# EAGLE design WeMos-shield (EAGLE 7.7.0)
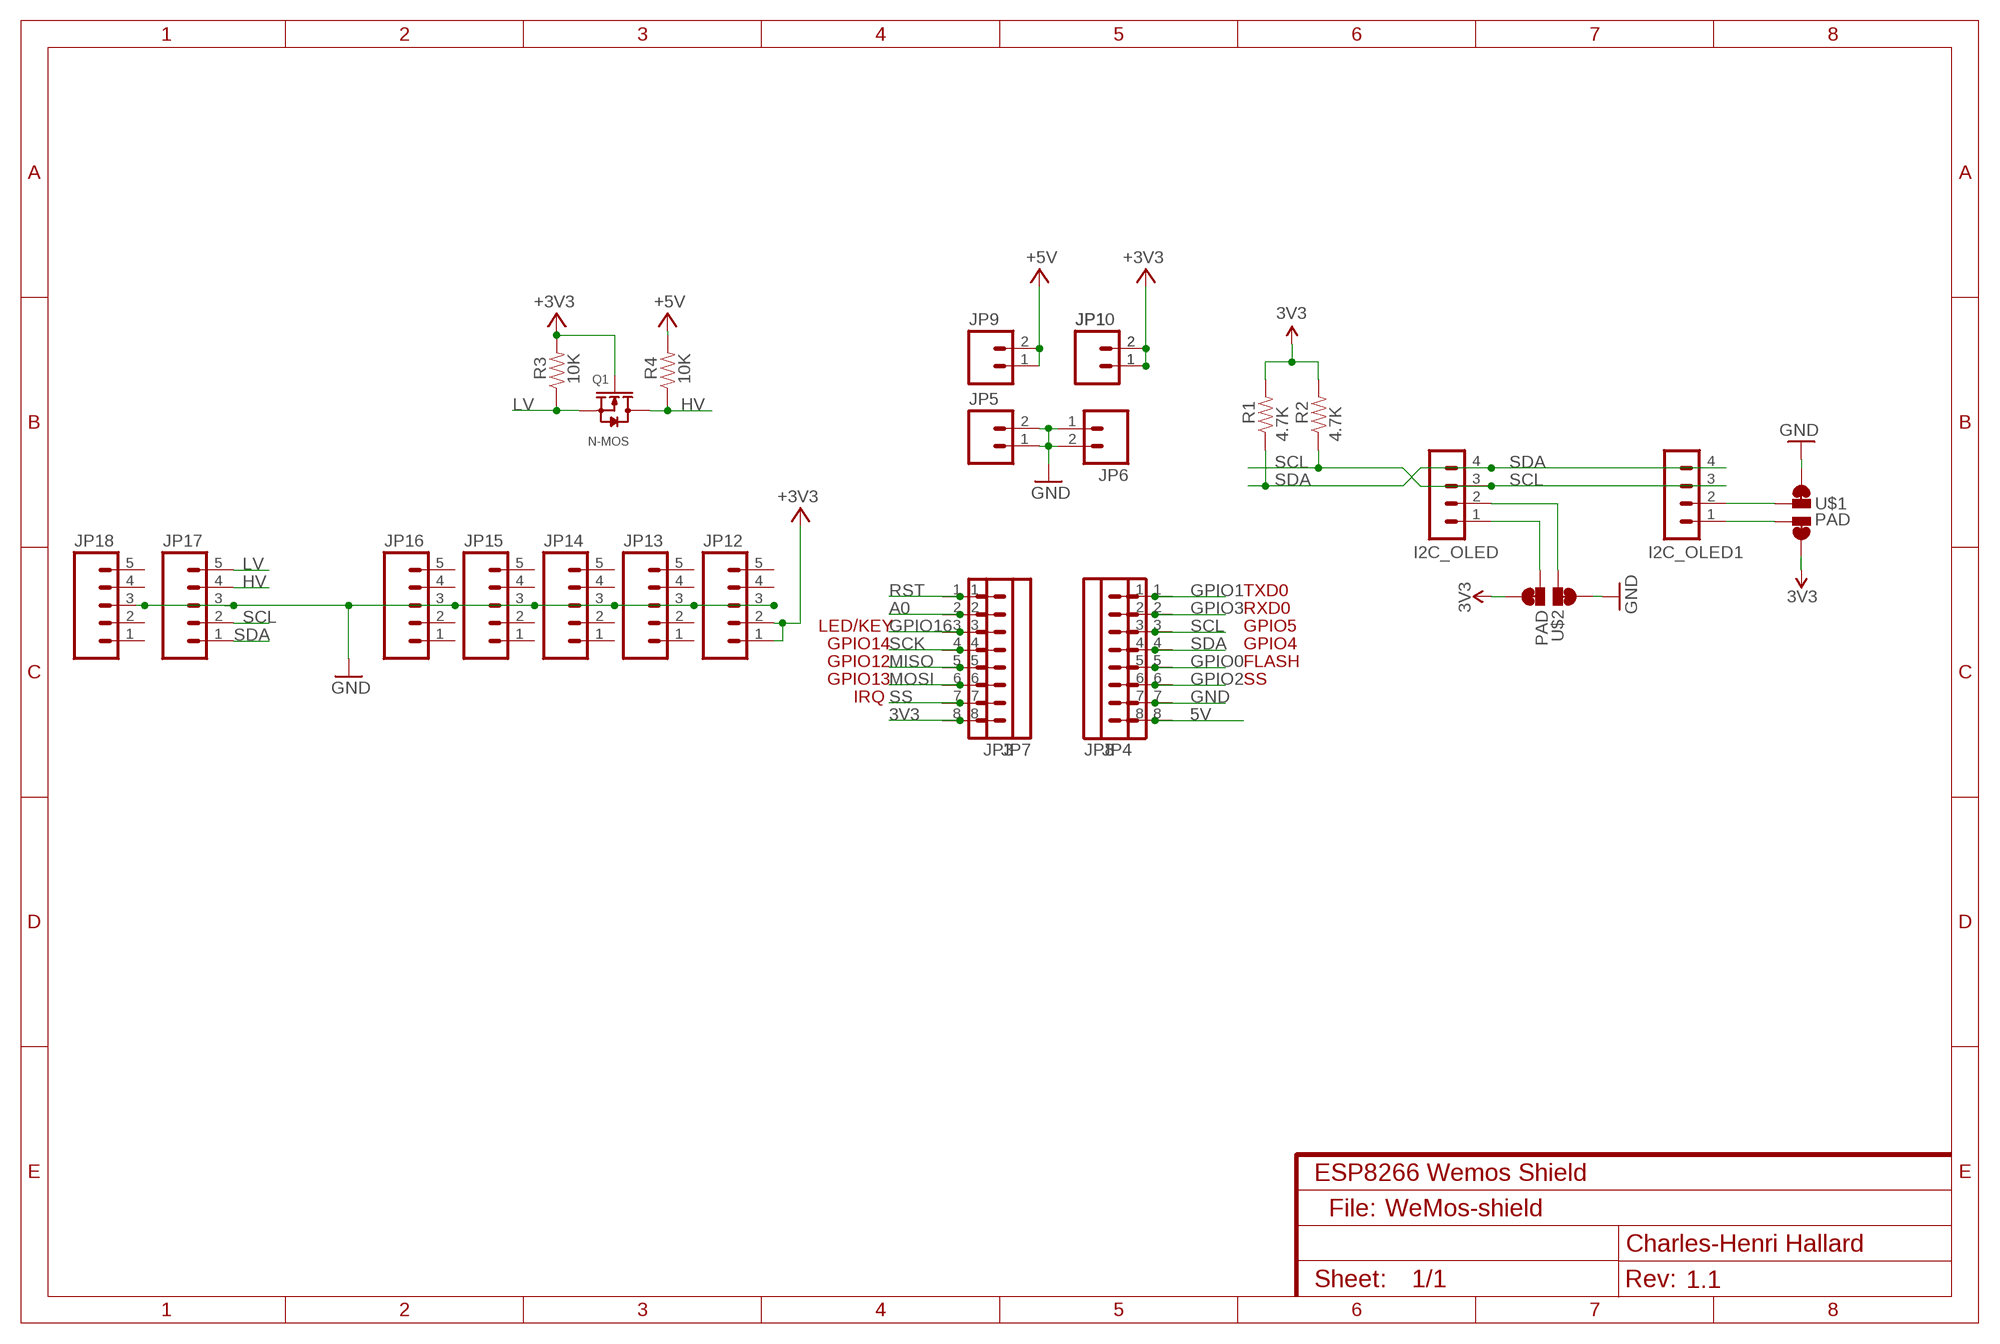
[diagram p0: schematic, sheet 1]
NAME (FRAME-A4L): CNAME: ESP8266 Wemos Shield; CREVISION: 1.1; DESIGNER: Charles-Henri Hallard

## Parts
I2C_OLED  CON_HEADER_1X04'SMALL''  [M1X4]
I2C_OLED1  CON_HEADER_1X04'SMALL''  [M1X4]
JP1  M021X02_NO_SILK  [1X02_NO_SILK]
JP3  M08NO_SILK_FEMALE_PTH  [1X08_NO_SILK]
JP4  M08NO_SILK_FEMALE_PTH  [1X08_NO_SILK]
JP5  M021X02_NO_SILK  [1X02_NO_SILK]
JP6  M021X02_NO_SILK  [1X02_NO_SILK]
JP7  M08NO_SILK_FEMALE_PTH  [1X08_NO_SILK]
JP8  M08NO_SILK_FEMALE_PTH  [1X08_NO_SILK]
JP9  M021X02_NO_SILK  [1X02_NO_SILK]
JP10  M021X02_NO_SILK  [1X02_NO_SILK]
JP12  M05NO_SILK  [1X05_NO_SILK]
JP13  M05NO_SILK  [1X05_NO_SILK]
JP14  M05NO_SILK  [1X05_NO_SILK]
JP15  M05NO_SILK  [1X05_NO_SILK]
JP16  M05NO_SILK  [1X05_NO_SILK]
JP17  M05NO_SILK  [1X05_NO_SILK]
JP18  M05NO_SILK  [1X05_NO_SILK]
Q1  N-MOS  MOSFET-N-''  [SOT23]
R1  4.7K  RESISTOR0805-RES  [0805-RES]
R2  4.7K  RESISTOR0805-RES  [0805-RES]
R3  10K  RESISTOR0805-RES  [0805-RES]
R4  10K  RESISTOR0805-RES  [0805-RES]
U$1  PAD  PAD-JUMPER-SWAPSWAP  [PAD-JUMPER-SWAP]
U$2  PAD  PAD-JUMPER-SWAPSWAP  [PAD-JUMPER-SWAP]

## Nets
3V3: JP1.1 JP1.2 JP3.8 JP7.8 JP10.1 JP10.2 JP12.1 JP12.2 Q1.1(G) R1.2 R2.2 R3.2 U$1.4 U$1.44 U$2.4 U$2.44 ; supply symbol labelled +3V3
5V: JP4.8 JP8.8 JP9.1 JP9.2 R4.2 ; supply symbol labelled +5V
A0: JP3.2 JP7.2
GND: JP4.7 JP5.1 JP5.2 JP6.1 JP6.2 JP8.7 JP12.3 JP13.3 JP14.3 JP15.3 JP16.3 JP17.3 JP18.3 U$1.1 U$1.11 U$2.1 U$2.11
GPIO0: JP4.5 JP8.5
GPIO1: JP4.1 JP8.1
GPIO2: JP4.6 JP8.6
GPIO3: JP4.2 JP8.2
GPIO16: JP3.3 JP7.3
HV: JP17.4 Q1.3(D) R4.1
LV: JP17.5 Q1.2(S) R3.1
MISO: JP3.5 JP7.5
MOSI: JP3.6 JP7.6
RST: JP3.1 JP7.1
SCK: JP3.4 JP7.4
SCL: I2C_OLED1.3 I2C_OLED.3 JP4.3 JP8.3 JP17.2 R2.1
SDA: I2C_OLED1.4 I2C_OLED.4 JP4.4 JP8.4 JP17.1 R1.1
SS: JP3.7 JP7.7
V+J: I2C_OLED.1 U$2.3
V+O: I2C_OLED1.1 U$1.3
V-J: I2C_OLED.2 U$2.2
V-O: I2C_OLED1.2 U$1.2
Unconnected: JP12.4 JP12.5 JP13.1 JP13.2 JP13.4 JP13.5 JP14.1 JP14.2 JP14.4 JP14.5 JP15.1 JP15.2 JP15.4 JP15.5 JP16.1 JP16.2 JP16.4 JP16.5 JP18.1 JP18.2 JP18.4 JP18.5

## Notes on the sheet
- TXD0
- RXD0
- LED/KEY | GPIO5
- GPIO14 | GPIO4
- GPIO12 | FLASH
- GPIO13 | SS
- IRQ
- File:

## Library data of the parts
I2C_OLED I2C_OLED1 = _c2h:CON_HEADER_1X04
JP1 JP5 JP6 JP9 JP10 = SparkFun-Connectors:M02: Standard 2-pin 0.1" header. Use with - straight break away headers ( PRT-00116) - right angle break away headers (PRT-00553) - swiss pins (PRT-00743) - machine pins (PRT-00117) - female headers (PRT-00115) Molex polarized connector foot print use with: PRT-08233 with associated crimp pins and housings. 2.54_SCREWTERM for use with PRT-10571. 3.5mm Screw Terminal footprints for PRT-08084 5mm Screw Terminal footprints for use with PRT-08432
JP3 JP4 JP7 JP8 = SparkFun-Connectors:M08: Header 8 Standard 8-pin 0.1" header. Use with straight break away headers (SKU : PRT-00116), right angle break away headers (PRT-00553), swiss pins (PRT-00743), machine pins (PRT-00117), and female headers (PRT-00115).; PROD_ID: CONN-08438
JP12-JP18 = SparkFun-Connectors:M05: Header 5 Standard 5-pin 0.1" header. Use with straight break away headers (SKU : PRT-00116), right angle break away headers (PRT-00553), swiss pins (PRT-00743), machine pins (PRT-00117), and female headers (PRT-00115). Molex polarized connector foot print use with SKU : PRT-08230 with associated crimp pins and housings.
Q1 = Seeed-Discrete:MOSFET-N: CJ2302：SMD MOSFET N-CH 20V-2.1A
R1-R4 = _c2h:RESISTOR: Resistor Basic schematic elements and footprints for 0603, 1206, and PTH resistors.
U$1 U$2 = _c2h:PAD-JUMPER-SWAP

## Net classes
0 default: width 0.203 mm, drill 0.356 mm, clearance 0.152 mm
1 power: width 0.203 mm, clearance 0.152 mm

## Board
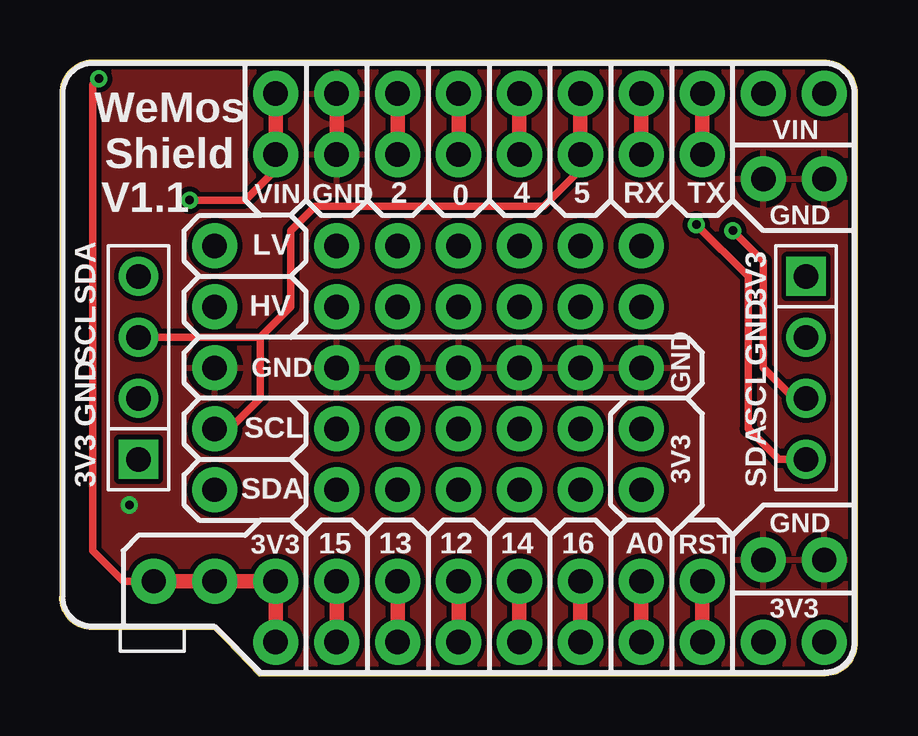
[diagram p1: board, top side]
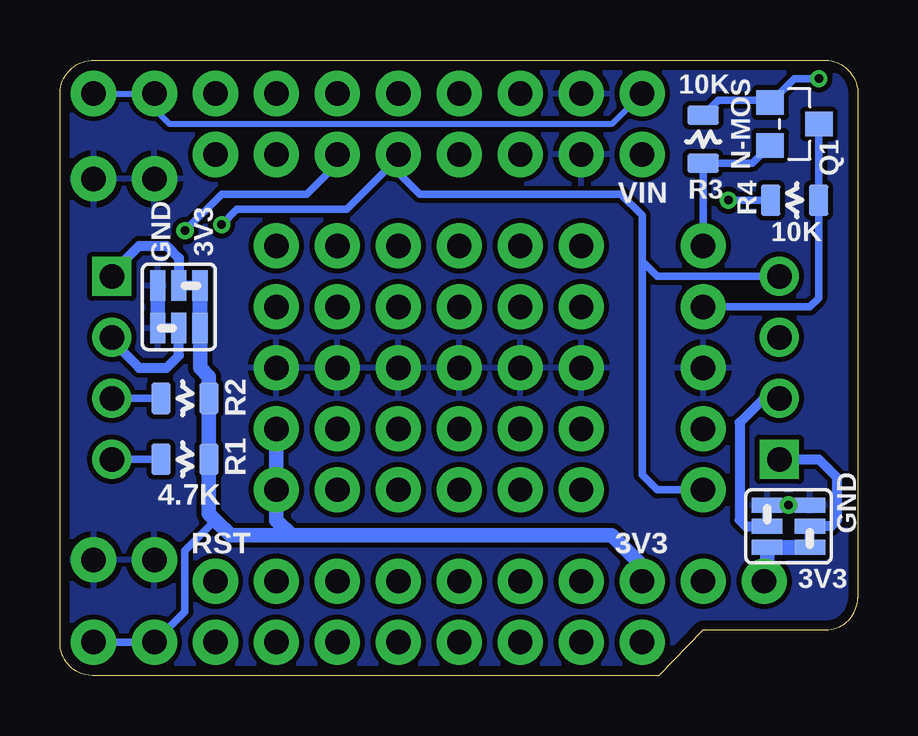
[diagram p2: board, bottom side, seen from below]

Size 33.24 x 25.65 mm. Coordinates in mm from the lower left corner, seen from the top.
Outline: 31.81,25.65 1.33,25.65 arc90 0,24.19 0,3.24 arc90 1.37,1.91 6.45,1.91 8.29,0 31.91,0 arc90 33.24,1.4 33.24,24.26 arc90 31.81,25.65
Copper layers (1*16): Top 0.0356mm / dielectric 1.5011mm / Bottom 0.0356mm
Design rules "PCBs_io": minimum track width 6mil, minimum drill 13mil, track to track 6mil, track to pad 6mil, pad to pad 6mil, via to via 6mil, smd to smd 6mil, copper to edge 15mil, drill to drill 6mil, minimum pad ring 7mil, minimum via ring 7mil, stop-mask expansion 3mil, vias tented up to drill 40mil, thermal gap 10mil

### Footprints (pad centres in the part's own frame; a part is rotated, then mirrored left to right if it is on the bottom)
M1X4 = drill 1.02 pad 1.632 square: 1 -3.81,0 | drill 1.02 pad 1.632: 2 -1.27,0; 3 1.27,0; 4 3.81,0
1X02_NO_SILK = drill 1.016 pad 1.88: 1 0,0; 2 2.54,0
1X08_NO_SILK = drill 1.016 pad 1.88: 1 0,0; 2 2.54,0; 3 5.08,0; 4 7.62,0; 5 10.16,0; 6 12.7,0; 7 15.24,0; 8 17.78,0
1X05_NO_SILK = drill 1.016 pad 1.88: 1 0,0; 2 2.54,0; 3 5.08,0; 4 7.62,0; 5 10.16,0
SOT23 = smd 1.016 x 1.143: 1 -0.889,-1.016; 2 0.889,-1.016; 3 0,1.016
0805-RES = smd 0.8 x 1.3: 1 -1,0; 2 1,0
PAD-JUMPER-SWAP = smd 0.635 x 1.27: 1 -0.876,0.889; 2 0,-0.889; 3 0,0.889; 4 0.876,-0.889; 11 -0.876,-0.889; 44 0.876,0.889

### Placement (x,y rotation side)
I2C_OLED  31.08,12.83 270 top
I2C_OLED1  3.27,12.83 90 top
JP1  31.85,1.4 180 top
JP3  26.77,1.4 180 top
JP4  26.77,24.26 180 top
JP5  31.85,4.83 180 top
JP6  31.85,20.7 180 top
JP7  26.77,3.94 180 top
JP8  26.77,21.72 180 top
JP9  29.31,24.26 0 top
JP10  3.91,3.94 0 top
JP12  24.23,7.75 90 top
JP13  21.69,7.75 90 top
JP14  19.15,7.75 90 top
JP15  14.07,7.75 90 top
JP16  16.61,7.75 90 top
JP17  6.45,7.75 90 top
JP18  11.53,7.75 90 top
Q1  2.64,22.99 270 bottom
R1  28.04,9.02 0 bottom
R2  28.04,11.56 0 bottom
R3  6.45,22.35 90 bottom
R4  2.64,19.81 180 bottom
U$1  2.89,6.22 270 bottom
U$2  28.29,15.37 0 bottom

### Tracks (layer width: path | path; a pad name or v marks a point on that pad's centre or on a via)
3V3  (via drill 0.36 pad 0.71)
  Top 0.305: v1.62,24.88 1.37,24.62 1.37,5.21 2.64,3.94 JP10.1
  Top 0.61: JP3.8 JP7.8 JP10.2 JP10.1
  Bottom 0.254: 3.76,23.99 Q1.1
  Bottom 0.305: v1.62,24.88 2.65,24.88 Q1.1 | 3.76,23.99 5.81,23.99 R3.2 | 26.77,6.48 28.04,5.21 28.04,2.67 JP1.2 JP1.1
  Bottom 0.61: 23.59,5.84 26.13,5.84 26.77,6.48 27.04,6.75 R1.2 R2.2 27.04,12.46 27.4,12.83 27.4,14.46 U$2.4 U$2.44 | 23.59,5.84 10.26,5.84 8.99,4.57 JP7.8 | JP12.2 JP12.1 24.23,6.48 23.59,5.84 | U$1.44 U$1.4 3.78,4.06 JP10.1
5V  (via drill 0.36 pad 0.71)
  Top 0.254: 8.99,21.08 JP8.8
  Top 0.305: v5.4,19.81 7.72,19.81 8.99,21.08
  Top 0.61: JP4.8 JP8.8
  Bottom 0.254: JP4.8 10.26,22.99 28.67,22.99 29.31,23.62 JP9.1 JP9.2
  Bottom 0.305: R4.2 v5.4,19.81
A0
  Top 0.61: JP7.2 JP3.2
GND  (via drill 0.36 pad 0.71)
  Top 0.61: JP4.7 JP8.7
  Bottom 0.305: v2.89,7.11 3.77,7.11 U$1.11
  Bottom 0.406: U$1.11 U$1.1
  pour Bottom (isolate 0.203): 34.39,26.8 34.39,-1.14 -1.17,-1.14 -1.17,26.8
  pour Top (isolate 0.203): -0.54,26.16 33.75,26.16 33.75,-0.51 -0.54,-0.51
GPIO0
  Top 0.61: JP4.5 JP8.5
GPIO1
  Top 0.61: JP4.1 JP8.1
GPIO2
  Top 0.61: JP4.6 JP8.6
GPIO3
  Top 0.61: JP4.2 JP8.2
GPIO16
  Top 0.61: JP7.3 JP3.3
HV
  Bottom 0.254: 1.62,19.83 R4.1
  Bottom 0.305: Q1.3 1.62,19.83 | JP17.4 2,15.37 1.64,15.73 R4.1
LV
  Bottom 0.254: 3.76,21.99 Q1.2
  Bottom 0.305: JP17.5 R3.1 4.4,21.35 Q1.2
MISO
  Top 0.61: JP7.5 JP3.5
MOSI
  Top 0.61: JP7.6 JP3.6
RST
  Top 0.61: JP7.1 JP3.1
SCK
  Top 0.61: JP7.4 JP3.4
SCL  (via drill 0.36 pad 0.71)
  Top 0.254: 21.81,22.22 21.69,22.35
  Top 0.305: 21.81,22.22 21.81,21.21 20.16,19.56 10.64,19.56 9.62,18.54 9.62,15.37 8.35,14.1 | 8.35,14.1 I2C_OLED1.3 | JP17.2 7.08,10.29 8.35,11.56 8.35,14.1 | v28.04,18.54 29.31,17.27 29.31,12.83 30.58,11.56 I2C_OLED.3
  Top 0.61: JP4.3 21.69,22.35 JP8.3
  Bottom 0.254: JP8.3 21.69,21.34
  Bottom 0.305: I2C_OLED.3 R2.1 | 21.69,21.34 22.96,20.07 26.51,20.07 v28.04,18.54
SDA  (via drill 0.36 pad 0.71)
  Top 0.305: v26.51,18.8 28.67,16.64 28.67,10.29 29.94,9.02 I2C_OLED.4
  Top 0.61: JP4.4 JP8.4
  Bottom 0.254: JP8.4 19.15,21.59
  Bottom 0.305: 19.15,21.59 21.3,19.43 25.88,19.43 v26.51,18.8 | JP8.4 19.15,20.95 18.26,20.07 9.87,20.07 8.99,19.18 8.99,17.27 | I2C_OLED1.4 8.35,16.64 8.99,17.27 | JP17.1 8.35,7.75 8.99,8.38 8.99,17.27 | R1.1 I2C_OLED.4
SS
  Top 0.61: JP7.7 JP3.7
V+J
  Bottom 0.406: I2C_OLED.1 31.08,16.76 29.94,17.91 28.8,17.91 28.29,17.4 U$2.3
V+O
  Bottom 0.406: I2C_OLED1.1 1.62,9.02 0.86,8.26 0.86,6.48 1.11,6.22 U$1.3
V-J
  Bottom 0.406: I2C_OLED.2 31.08,13.97 29.94,12.83 28.8,12.83 28.29,13.34 U$2.2
V-O
  Bottom 0.406: I2C_OLED1.2 3.91,11.56 4.92,10.54 4.92,6.48 4.67,6.22 U$1.2

### Text on the board
tNames: WeMos / Shield | VIN | V1.1 | VIN | GND | 2 | 4 | 5 | RX | TX | 0 | GND | LV | HV | SDA | 3V3 | SCL | GND | GND | GND | SCL | GND | SCL | 3V3 | SDA | 3V3 | SDA | GND | 3V3 | 15 | 13 | 12 | 14 | 16 | A0 | RST | 3V3
bNames: VIN | 3V3 | GND | GND | 3V3 | RST | 3V3